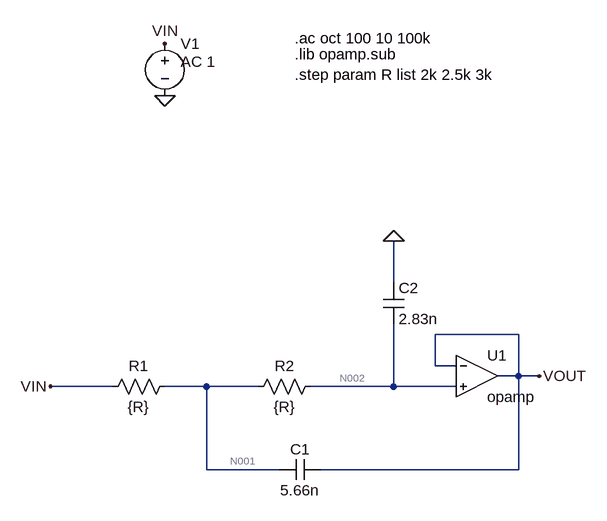
[diagram p0: schematic lpf_math.asc]
lpf_math.asc, the LTspice schematic file:
Version 4.1
SHEET 1 880 680
WIRE 240 80 240 16
WIRE 432 160 304 160
WIRE 304 208 304 160
WIRE 336 208 304 208
WIRE 432 224 432 160
WIRE 432 224 400 224
WIRE 464 224 432 224
WIRE -192 240 -288 240
WIRE -48 240 -112 240
WIRE 32 240 -48 240
WIRE 240 240 240 144
WIRE 240 240 112 240
WIRE 336 240 240 240
WIRE -48 368 -48 240
WIRE 64 368 -48 368
WIRE 432 368 432 224
WIRE 432 368 128 368
FLAG 464 224 VOUT
FLAG -288 240 VIN
FLAG 240 16 0
FLAG -112 -288 VIN
FLAG -112 -208 0
SYMBOL OpAmps\\opamp 368 160 R0
SYMATTR InstName U1
SYMBOL voltage -112 -304 R0
WINDOW 123 24 44 Left 2
WINDOW 39 0 0 Left 0
SYMATTR Value2 AC 1
SYMATTR InstName V1
SYMATTR Value ""
SYMBOL cap 224 80 R0
SYMATTR InstName C2
SYMATTR Value 2.83n
SYMBOL cap 128 352 R90
WINDOW 0 0 32 VBottom 2
WINDOW 3 32 32 VTop 2
SYMATTR InstName C1
SYMATTR Value 5.66n
SYMBOL res -96 224 R90
WINDOW 0 0 56 VBottom 2
WINDOW 3 32 56 VTop 2
SYMATTR InstName R1
SYMATTR Value {R}
SYMBOL res 128 224 R90
WINDOW 0 0 56 VBottom 2
WINDOW 3 32 56 VTop 2
SYMATTR InstName R2
SYMATTR Value {R}
TEXT 88 -296 Left 2 !.ac oct 100 10 100k
TEXT 88 -272 Left 2 !.lib opamp.sub
TEXT 88 -240 Left 2 !.step param R list 2k 2.5k 3k

The netlist it stands for:
* lpf_math.asc
X§U1 VOUT N002 VOUT opamp Aol=100K GBW=10Meg  ; pins invin noninvin out
V1 VIN 0 AC 1
C2 0 N002 2.83n
C1 VOUT N001 5.66n
R1 N001 VIN {R}
R2 N002 N001 {R}
.ac oct 100 10 100k
.lib opamp.sub
.step param R list 2k 2.5k 3k
.backanno
.end

* Results of the author's LTspice run, read from the files saved beside the schematic
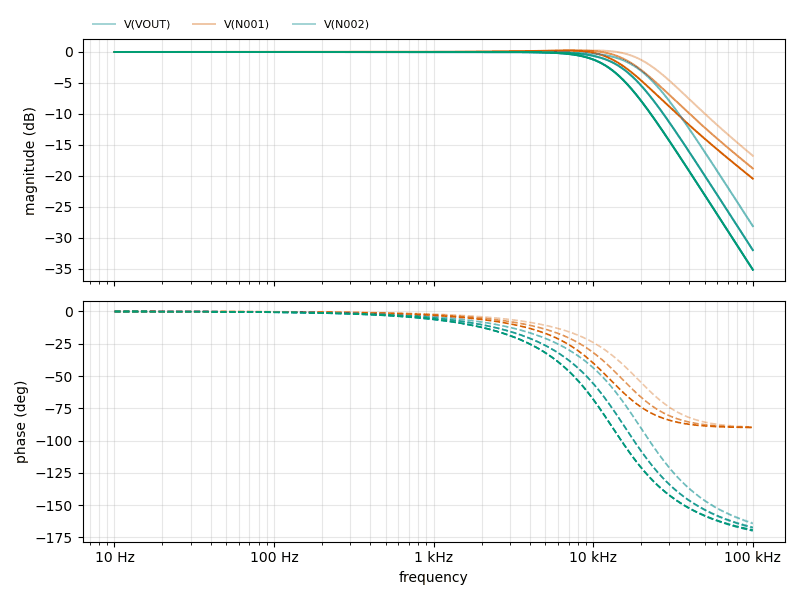
[diagram p1: AC Analysis of lpf_math.asc, plotted from the saved traces]
* AC Analysis, 3 runs:
*   V(VOUT) [r=2000]: -0.00 dB at 10 Hz, -28.09 dB at 100 kHz, peak -0.00 dB at 1.047 kHz, 3 dB below the peak at 19.88 kHz
*   V(VOUT) [r=2500]: -0.00 dB at 10 Hz, -31.96 dB at 100 kHz, peak -0.00 dB at 750.6 Hz, 3 dB below the peak at 15.91 kHz
*   V(VOUT) [r=3000]: -0.00 dB at 10 Hz, -35.12 dB at 100 kHz, peak -0.00 dB at 568.9 Hz, 3 dB below the peak at 13.26 kHz
*   V(N001) [r=2000]: 0.00 dB at 10 Hz, -16.74 dB at 100 kHz, peak 0.25 dB at 9.688 kHz, 3 dB below the peak at 24.54 kHz
*   V(N001) [r=2500]: 0.00 dB at 10 Hz, -18.79 dB at 100 kHz, peak 0.25 dB at 7.76 kHz, 3 dB below the peak at 19.63 kHz
*   V(N001) [r=3000]: 0.00 dB at 10 Hz, -20.43 dB at 100 kHz, peak 0.25 dB at 6.436 kHz, 3 dB below the peak at 16.36 kHz
*   V(N002) [r=2000]: 0.00 dB at 10 Hz, -28.09 dB at 100 kHz, peak 0.00 dB at 1.047 kHz, 3 dB below the peak at 19.88 kHz
*   V(N002) [r=2500]: 0.00 dB at 10 Hz, -31.96 dB at 100 kHz, peak 0.00 dB at 750.6 Hz, 3 dB below the peak at 15.91 kHz
*   V(N002) [r=3000]: 0.00 dB at 10 Hz, -35.12 dB at 100 kHz, peak 0.00 dB at 568.9 Hz, 3 dB below the peak at 13.26 kHz